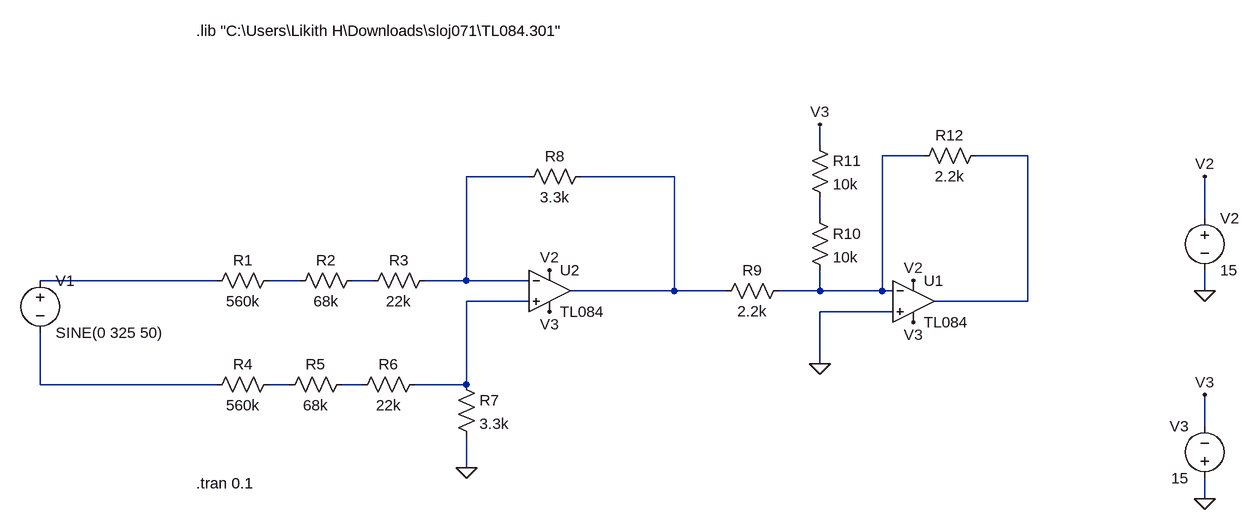
[diagram p0: schematic sccmp.asc]
sccmp.asc, the LTspice schematic file:
Version 4
SHEET 1 1432 680
WIRE 784 -80 784 -112
WIRE 944 -64 880 -64
WIRE 1104 -64 1024 -64
WIRE 336 -32 240 -32
WIRE 560 -32 416 -32
WIRE 784 32 784 0
WIRE 1376 32 1376 -32
WIRE -144 128 -416 128
WIRE -16 128 -64 128
WIRE 96 128 64 128
WIRE 240 128 240 -32
WIRE 240 128 176 128
WIRE 336 128 240 128
WIRE 560 144 560 -32
WIRE 560 144 400 144
WIRE 640 144 560 144
WIRE 784 144 784 112
WIRE 784 144 720 144
WIRE 880 144 880 -64
WIRE 880 144 784 144
WIRE 896 144 880 144
WIRE 1376 144 1376 112
WIRE 336 160 240 160
WIRE 1104 160 1104 -64
WIRE 1104 160 960 160
WIRE 896 176 784 176
WIRE 784 256 784 176
WIRE -416 288 -416 208
WIRE -144 288 -416 288
WIRE -32 288 -64 288
WIRE 80 288 48 288
WIRE 240 288 240 160
WIRE 240 288 160 288
WIRE 1376 352 1376 304
WIRE 240 416 240 368
WIRE 1376 464 1376 432
FLAG 240 416 0
FLAG 1376 144 0
FLAG 1376 464 0
FLAG 1376 304 V3
FLAG 368 112 V2
FLAG 368 176 V3
FLAG 784 256 0
FLAG 1376 -32 V2
FLAG 784 -112 V3
FLAG 928 128 V2
FLAG 928 192 V3
SYMBOL voltage -416 112 R0
WINDOW 123 0 0 Left 0
WINDOW 39 0 0 Left 0
SYMATTR InstName V1
SYMATTR Value SINE(0 325 50)
SYMBOL OpAmps\\opamp2 368 80 R0
SYMATTR InstName U2
SYMATTR Value TL084
SYMBOL res 224 272 R0
SYMATTR InstName R7
SYMATTR Value 3.3k
SYMBOL res 176 272 R90
WINDOW 0 0 56 VBottom 2
WINDOW 3 32 56 VTop 2
SYMATTR InstName R6
SYMATTR Value 22k
SYMBOL res 192 112 R90
WINDOW 0 0 56 VBottom 2
WINDOW 3 32 56 VTop 2
SYMATTR InstName R3
SYMATTR Value 22k
SYMBOL res 432 -48 R90
WINDOW 0 0 56 VBottom 2
WINDOW 3 32 56 VTop 2
SYMATTR InstName R8
SYMATTR Value 3.3k
SYMBOL voltage 1376 16 R0
WINDOW 123 0 0 Left 0
WINDOW 39 0 0 Left 0
SYMATTR InstName V2
SYMATTR Value 15
SYMBOL voltage 1376 448 R180
WINDOW 0 24 96 Left 2
WINDOW 3 24 16 Left 2
WINDOW 123 0 0 Left 0
WINDOW 39 0 0 Left 0
SYMATTR InstName V3
SYMATTR Value 15
SYMBOL OpAmps\\opamp2 928 96 R0
SYMATTR InstName U1
SYMATTR Value TL084
SYMBOL res 736 128 R90
WINDOW 0 0 56 VBottom 2
WINDOW 3 32 56 VTop 2
SYMATTR InstName R9
SYMATTR Value 2.2k
SYMBOL res 768 16 R0
SYMATTR InstName R10
SYMATTR Value 10k
SYMBOL res 1040 -80 R90
WINDOW 0 0 56 VBottom 2
WINDOW 3 32 56 VTop 2
SYMATTR InstName R12
SYMATTR Value 2.2k
SYMBOL res 80 112 R90
WINDOW 0 0 56 VBottom 2
WINDOW 3 32 56 VTop 2
SYMATTR InstName R2
SYMATTR Value 68k
SYMBOL res -48 112 R90
WINDOW 0 0 56 VBottom 2
WINDOW 3 32 56 VTop 2
SYMATTR InstName R1
SYMATTR Value 560k
SYMBOL res 64 272 R90
WINDOW 0 0 56 VBottom 2
WINDOW 3 32 56 VTop 2
SYMATTR InstName R5
SYMATTR Value 68k
SYMBOL res -48 272 R90
WINDOW 0 0 56 VBottom 2
WINDOW 3 32 56 VTop 2
SYMATTR InstName R4
SYMATTR Value 560k
SYMBOL res 768 -96 R0
SYMATTR InstName R11
SYMATTR Value 10k
TEXT -176 -256 Left 2 !.lib "C:\\Users\\Likith H\\Downloads\\sloj071\\TL084.301"
TEXT -176 440 Left 2 !.tran 0.1

The netlist it stands for:
* sccmp.asc
V1 N006 N010 SINE(0 325 50)
XU2 N009 N003 V2 V3 N004 TL084  ; pins In+ In- V+ V- OUT
R7 N009 0 3.3k
R6 N009 N012 22k
R3 N003 N008 22k
R8 N004 N003 3.3k
V2 V2 0 15
V3 0 V3 15
XU1 0 N001 V2 V3 N002 TL084  ; pins In+ In- V+ V- OUT
R9 N001 N004 2.2k
R10 N005 N001 10k
R12 N002 N001 2.2k
R2 N008 N007 68k
R1 N007 N006 560k
R5 N012 N011 68k
R4 N011 N010 560k
R11 V3 N005 10k
.lib "C:\Users\Likith H\Downloads\sloj071\TL084.301"
.tran 0.1
.backanno
.end